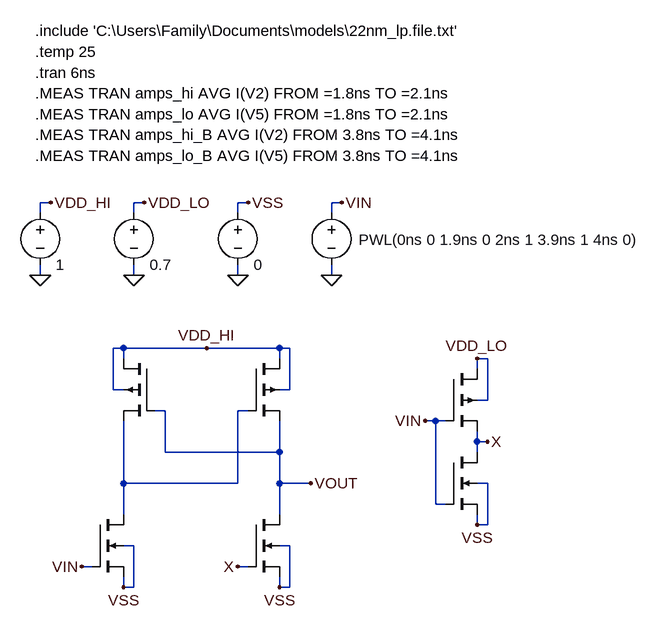
[diagram p0: schematic Q3.asc]
Q3.asc, the LTspice schematic file:
Version 4
SHEET 1 1484 680
WIRE 64 -128 48 -128
WIRE 208 -128 192 -128
WIRE 368 -128 352 -128
WIRE 512 -128 496 -128
WIRE 48 -112 48 -128
WIRE 192 -112 192 -128
WIRE 352 -112 352 -128
WIRE 496 -112 496 -128
WIRE 48 -16 48 -32
WIRE 192 -16 192 -32
WIRE 352 -16 352 -32
WIRE 496 -16 496 -32
WIRE 176 96 160 96
WIRE 304 96 176 96
WIRE 416 96 304 96
WIRE 432 96 416 96
WIRE 176 112 176 96
WIRE 416 112 416 96
WIRE 736 112 720 112
WIRE 720 128 720 112
WIRE 160 160 160 96
WIRE 176 160 160 160
WIRE 432 160 432 96
WIRE 432 160 416 160
WIRE 736 176 736 112
WIRE 736 176 720 176
WIRE 240 192 224 192
WIRE 368 192 352 192
WIRE 656 208 640 208
WIRE 672 208 656 208
WIRE 720 240 720 224
WIRE 736 240 720 240
WIRE 240 256 240 192
WIRE 416 256 416 208
WIRE 416 256 240 256
WIRE 720 256 720 240
WIRE 176 304 176 208
WIRE 352 304 352 192
WIRE 352 304 176 304
WIRE 416 304 416 256
WIRE 464 304 416 304
WIRE 736 304 720 304
WIRE 656 336 656 208
WIRE 672 336 656 336
WIRE 176 352 176 304
WIRE 416 352 416 304
WIRE 720 368 720 352
WIRE 736 368 736 304
WIRE 736 368 720 368
WIRE 192 400 176 400
WIRE 432 400 416 400
WIRE 128 432 112 432
WIRE 368 432 352 432
WIRE 176 464 176 448
WIRE 192 464 192 400
WIRE 192 464 176 464
WIRE 416 464 416 448
WIRE 432 464 432 400
WIRE 432 464 416 464
FLAG 496 -16 0
FLAG 352 -16 0
FLAG 512 -128 VIN
FLAG 368 -128 VSS
FLAG 48 -16 0
FLAG 192 -16 0
FLAG 64 -128 VDD_HI
FLAG 208 -128 VDD_LO
FLAG 112 432 VIN
FLAG 640 208 VIN
FLAG 736 240 X
FLAG 352 432 X
FLAG 464 304 VOUT
FLAG 304 96 VDD_HI
FLAG 720 112 VDD_LO
FLAG 720 368 VSS
FLAG 416 464 VSS
FLAG 176 464 VSS
SYMBOL voltage 496 -128 R0
WINDOW 0 24 16 Invisible 2
WINDOW 3 42 57 Left 2
WINDOW 123 0 0 Left 2
WINDOW 39 0 0 Left 2
SYMATTR InstName V3
SYMATTR Value PWL(0ns 0 1.9ns 0 2ns 1 3.9ns 1 4ns 0)
SYMBOL voltage 352 -128 R0
WINDOW 0 24 16 Invisible 2
SYMATTR InstName V4
SYMATTR Value 0
SYMBOL pmos4 224 112 M0
WINDOW 0 56 32 Invisible 2
WINDOW 3 56 72 Invisible 2
SYMATTR InstName M1
SYMATTR Value2 l=0.03u w=0.12u
SYMBOL pmos4 368 112 R0
WINDOW 0 56 32 Invisible 2
WINDOW 3 56 72 Invisible 2
SYMATTR InstName M2
SYMATTR Value2 l=0.03u w=0.12u
SYMBOL nmos4 128 352 R0
WINDOW 0 56 32 Invisible 2
WINDOW 3 56 72 Invisible 2
SYMATTR InstName M3
SYMATTR Value2 l=0.03u w=2u
SYMBOL nmos4 368 352 R0
WINDOW 0 56 32 Invisible 2
WINDOW 3 56 72 Invisible 2
SYMATTR InstName M4
SYMATTR Value2 l=0.03u w=2u
SYMBOL voltage 48 -128 R0
WINDOW 0 24 16 Invisible 2
SYMATTR InstName V2
SYMATTR Value 1
SYMBOL voltage 192 -128 R0
WINDOW 0 24 16 Invisible 2
SYMATTR InstName V5
SYMATTR Value 0.7
SYMBOL nmos4 672 256 R0
WINDOW 0 56 32 Invisible 2
WINDOW 3 56 72 Invisible 2
SYMATTR InstName M6
SYMATTR Value2 l=0.03u w=0.4u
SYMBOL pmos4 672 128 R0
WINDOW 0 56 32 Invisible 2
WINDOW 3 56 72 Invisible 2
SYMATTR InstName M5
SYMATTR Value2 l=0.03u w=0.7u
TEXT 40 -392 Left 2 !.include 'C:\\Users\\Family\\Documents\\models\\22nm_lp.file.txt'
TEXT 40 -360 Left 2 !.temp 25
TEXT 40 -328 Left 2 !.tran 6ns
TEXT 40 -296 Left 2 !.MEAS TRAN amps_hi AVG I(V2) FROM =1.8ns TO =2.1ns
TEXT 40 -200 Left 2 !.MEAS TRAN amps_lo_B AVG I(V5) FROM 3.8ns TO =4.1ns
TEXT 40 -264 Left 2 !.MEAS TRAN amps_lo AVG I(V5) FROM =1.8ns TO =2.1ns
TEXT 40 -232 Left 2 !.MEAS TRAN amps_hi_B AVG I(V2) FROM 3.8ns TO =4.1ns

The netlist it stands for:
* Q3.asc
V3 VIN 0 PWL(0ns 0 1.9ns 0 2ns 1 3.9ns 1 4ns 0)
V4 VSS 0 0
M1 VDD_HI VOUT N001 VDD_HI PMOS l=0.03u w=0.12u
M2 VDD_HI N001 VOUT VDD_HI PMOS l=0.03u w=0.12u
M3 N001 VIN VSS VSS NMOS l=0.03u w=2u
M4 VOUT X VSS VSS NMOS l=0.03u w=2u
V2 VDD_HI 0 1
V5 VDD_LO 0 0.7
M6 X VIN VSS VSS NMOS l=0.03u w=0.4u
M5 VDD_LO VIN X VDD_LO PMOS l=0.03u w=0.7u
.model NMOS NMOS
.model PMOS PMOS
.lib standard.mos
.include 'C:\Users\Family\Documents\models\22nm_lp.file.txt'
.temp 25
.tran 6ns
.MEAS TRAN amps_hi AVG I(V2) FROM =1.8ns TO =2.1ns
.MEAS TRAN amps_lo_B AVG I(V5) FROM 3.8ns TO =4.1ns
.MEAS TRAN amps_lo AVG I(V5) FROM =1.8ns TO =2.1ns
.MEAS TRAN amps_hi_B AVG I(V2) FROM 3.8ns TO =4.1ns
.backanno
.end